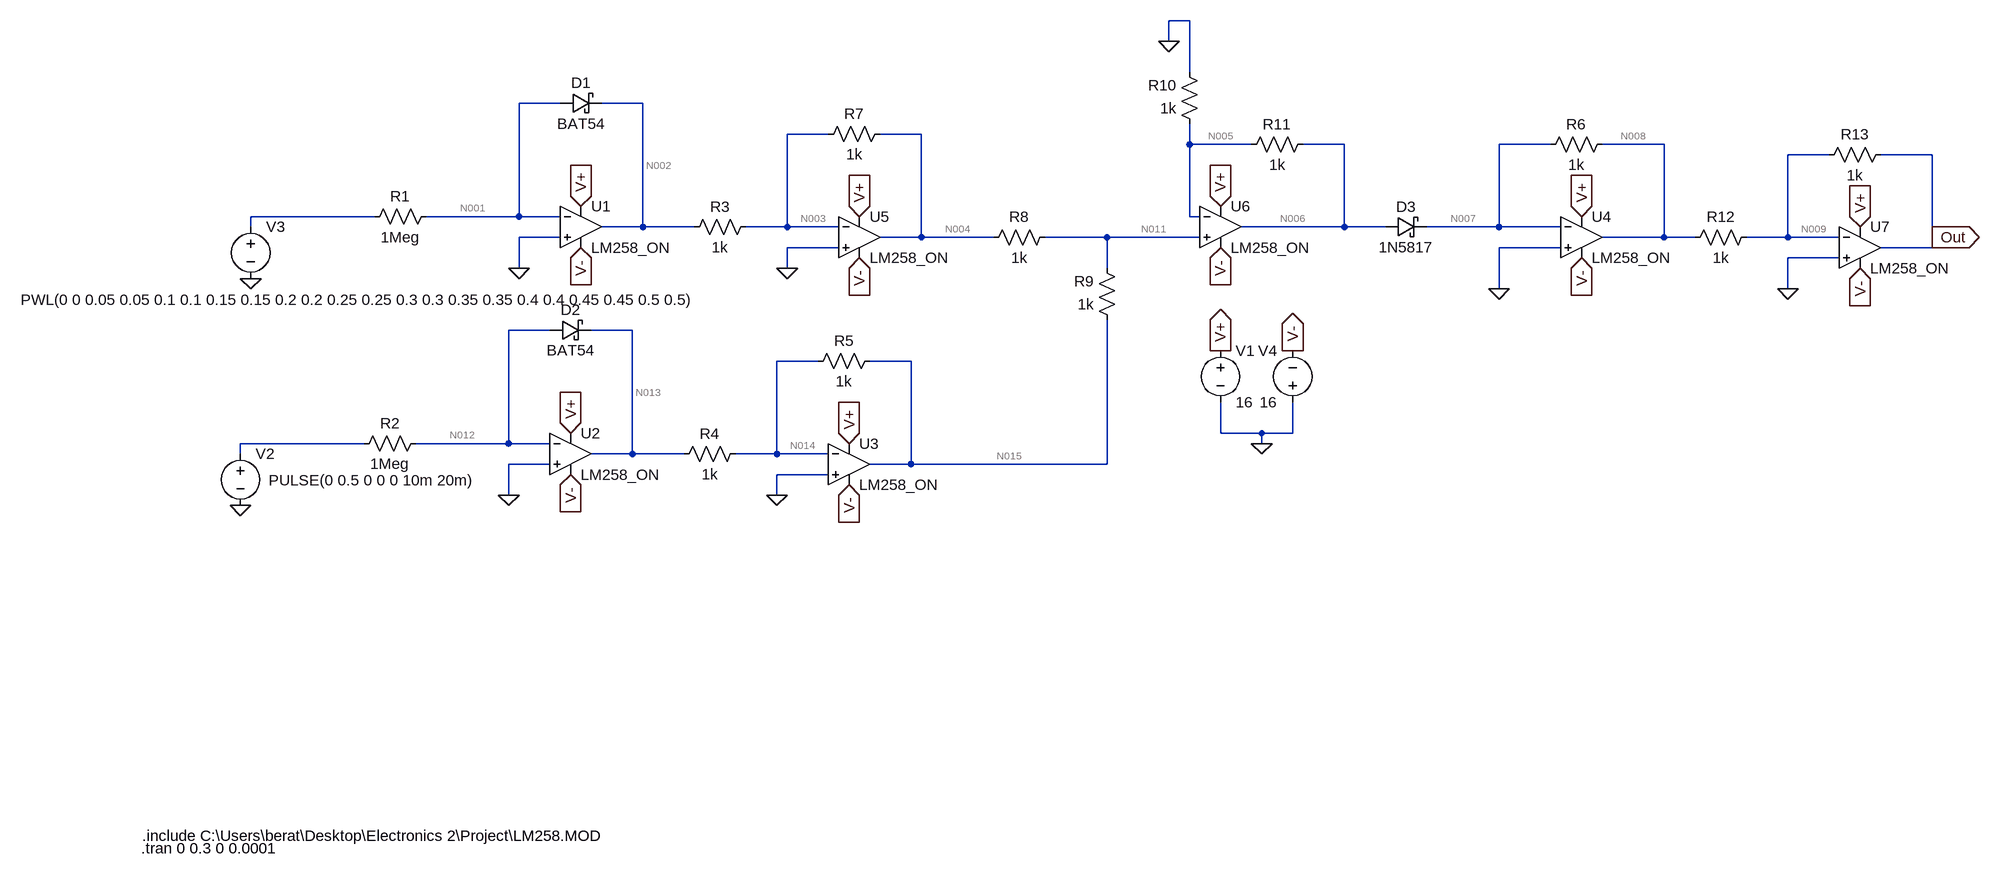
[diagram p0: schematic Draft1.asc]
Draft1.asc, the LTspice schematic file:
Version 4
SHEET 1 2132 680
WIRE 688 -672 656 -672
WIRE 656 -640 656 -672
WIRE 688 -592 688 -672
WIRE -288 -544 -352 -544
WIRE -160 -544 -224 -544
WIRE 128 -496 64 -496
WIRE 272 -496 208 -496
WIRE 688 -480 688 -512
WIRE 784 -480 688 -480
WIRE 928 -480 864 -480
WIRE 1248 -480 1168 -480
WIRE 1424 -480 1328 -480
WIRE 1680 -464 1616 -464
WIRE 1840 -464 1760 -464
WIRE -576 -368 -768 -368
WIRE -352 -368 -352 -544
WIRE -352 -368 -496 -368
WIRE -288 -368 -352 -368
WIRE 688 -368 688 -480
WIRE 704 -368 688 -368
WIRE -768 -352 -768 -368
WIRE -160 -352 -160 -544
WIRE -160 -352 -224 -352
WIRE -80 -352 -160 -352
WIRE 64 -352 64 -496
WIRE 64 -352 0 -352
WIRE 144 -352 64 -352
WIRE 928 -352 928 -480
WIRE 928 -352 768 -352
WIRE 992 -352 928 -352
WIRE 1168 -352 1168 -480
WIRE 1168 -352 1056 -352
WIRE 1264 -352 1168 -352
WIRE -288 -336 -352 -336
WIRE 272 -336 272 -496
WIRE 272 -336 208 -336
WIRE 384 -336 272 -336
WIRE 560 -336 464 -336
WIRE 704 -336 560 -336
WIRE 1424 -336 1424 -480
WIRE 1424 -336 1328 -336
WIRE 1472 -336 1424 -336
WIRE 1616 -336 1616 -464
WIRE 1616 -336 1552 -336
WIRE 1696 -336 1616 -336
WIRE 1840 -336 1840 -464
WIRE 144 -320 64 -320
WIRE 1264 -320 1168 -320
WIRE 1840 -320 1840 -336
WIRE 1840 -320 1760 -320
WIRE 1696 -304 1616 -304
WIRE -352 -288 -352 -336
WIRE 64 -288 64 -320
WIRE 560 -288 560 -336
WIRE 1168 -256 1168 -320
WIRE 1616 -256 1616 -304
WIRE -304 -192 -368 -192
WIRE -176 -192 -240 -192
WIRE 112 -144 48 -144
WIRE 256 -144 192 -144
WIRE 736 -32 736 -80
WIRE 800 -32 736 -32
WIRE 848 -32 848 -80
WIRE 848 -32 800 -32
WIRE -592 -16 -784 -16
WIRE -368 -16 -368 -192
WIRE -368 -16 -512 -16
WIRE -304 -16 -368 -16
WIRE 800 -16 800 -32
WIRE -784 0 -784 -16
WIRE -176 0 -176 -192
WIRE -176 0 -240 0
WIRE -96 0 -176 0
WIRE 48 0 48 -144
WIRE 48 0 -16 0
WIRE 128 0 48 0
WIRE -304 16 -368 16
WIRE 256 16 256 -144
WIRE 256 16 192 16
WIRE 560 16 560 -208
WIRE 560 16 256 16
WIRE 128 32 48 32
WIRE -368 64 -368 16
WIRE 48 64 48 32
FLAG 800 -16 0
FLAG 736 -160 V+
IOPIN 736 -160 Out
FLAG 848 -160 V-
IOPIN 848 -160 Out
FLAG -256 -384 V+
IOPIN -256 -384 In
FLAG -256 -320 V-
IOPIN -256 -320 In
FLAG -768 -272 0
FLAG 1296 -368 V+
IOPIN 1296 -368 In
FLAG 1296 -304 V-
IOPIN 1296 -304 In
FLAG -352 -288 0
FLAG 1168 -256 0
FLAG 176 -368 V+
IOPIN 176 -368 In
FLAG 176 -304 V-
IOPIN 176 -304 In
FLAG -272 -32 V+
IOPIN -272 -32 In
FLAG -272 32 V-
IOPIN -272 32 In
FLAG -784 80 0
FLAG -368 64 0
FLAG 160 -16 V+
IOPIN 160 -16 In
FLAG 160 48 V-
IOPIN 160 48 In
FLAG 64 -288 0
FLAG 48 64 0
FLAG 736 -384 V+
IOPIN 736 -384 In
FLAG 736 -320 V-
IOPIN 736 -320 In
FLAG 656 -640 0
FLAG 1728 -352 V+
IOPIN 1728 -352 In
FLAG 1728 -288 V-
IOPIN 1728 -288 In
FLAG 1616 -256 0
FLAG 1840 -336 Out
IOPIN 1840 -336 Out
SYMBOL OpAmps\\opamp2 -256 -416 R0
SYMATTR InstName U1
SYMATTR Value LM258_ON
SYMBOL voltage 736 -176 R0
WINDOW 123 0 0 Left 0
WINDOW 39 0 0 Left 0
SYMATTR InstName V1
SYMATTR Value 16
SYMBOL res -480 -384 R90
WINDOW 0 0 56 VBottom 2
WINDOW 3 32 56 VTop 2
SYMATTR InstName R1
SYMATTR Value 1Meg
SYMBOL schottky -288 -528 R270
WINDOW 0 32 32 VTop 2
WINDOW 3 0 32 VBottom 2
SYMATTR InstName D1
SYMATTR Value BAT54
SYMATTR Description Diode
SYMATTR Type diode
SYMBOL voltage -768 -368 R0
WINDOW 123 0 0 Left 0
WINDOW 39 0 0 Left 0
WINDOW 3 -357 129 Left 2
SYMATTR InstName V3
SYMATTR Value PWL(0 0 0.05 0.05 0.1 0.1 0.15 0.15 0.2 0.2 0.25 0.25 0.3 0.3 0.35 0.35 0.4 0.4 0.45 0.45 0.5 0.5)
SYMBOL res 16 -368 R90
WINDOW 0 0 56 VBottom 2
WINDOW 3 32 56 VTop 2
SYMATTR InstName R3
SYMATTR Value 1k
SYMBOL schottky 992 -336 R270
WINDOW 0 32 32 VTop 2
WINDOW 3 0 32 VBottom 2
SYMATTR InstName D3
SYMATTR Value 1N5817
SYMATTR Description Diode
SYMATTR Type diode
SYMBOL OpAmps\\opamp2 1296 -400 R0
SYMATTR InstName U4
SYMATTR Value LM258_ON
SYMBOL res 1344 -496 R90
WINDOW 0 0 56 VBottom 2
WINDOW 3 32 56 VTop 2
SYMATTR InstName R6
SYMATTR Value 1k
SYMBOL OpAmps\\opamp2 176 -400 R0
SYMATTR InstName U5
SYMATTR Value LM258_ON
SYMBOL res 224 -512 R90
WINDOW 0 0 56 VBottom 2
WINDOW 3 32 56 VTop 2
SYMATTR InstName R7
SYMATTR Value 1k
SYMBOL OpAmps\\opamp2 -272 -64 R0
SYMATTR InstName U2
SYMATTR Value LM258_ON
SYMBOL res -496 -32 R90
WINDOW 0 0 56 VBottom 2
WINDOW 3 32 56 VTop 2
SYMATTR InstName R2
SYMATTR Value 1Meg
SYMBOL schottky -304 -176 R270
WINDOW 0 32 32 VTop 2
WINDOW 3 0 32 VBottom 2
SYMATTR InstName D2
SYMATTR Value BAT54
SYMATTR Description Diode
SYMATTR Type diode
SYMBOL voltage -784 -16 R0
WINDOW 123 0 0 Left 0
WINDOW 39 0 0 Left 0
WINDOW 3 44 57 Left 2
SYMATTR InstName V2
SYMATTR Value PULSE(0 0.5 0 0 0 10m 20m)
SYMBOL res 0 -16 R90
WINDOW 0 0 56 VBottom 2
WINDOW 3 32 56 VTop 2
SYMATTR InstName R4
SYMATTR Value 1k
SYMBOL OpAmps\\opamp2 160 -48 R0
SYMATTR InstName U3
SYMATTR Value LM258_ON
SYMBOL res 208 -160 R90
WINDOW 0 0 56 VBottom 2
WINDOW 3 32 56 VTop 2
SYMATTR InstName R5
SYMATTR Value 1k
SYMBOL voltage 848 -64 R180
WINDOW 0 24 96 Left 2
WINDOW 3 24 16 Left 2
WINDOW 123 0 0 Left 0
WINDOW 39 0 0 Left 0
SYMATTR InstName V4
SYMATTR Value 16
SYMBOL res 480 -352 R90
WINDOW 0 0 56 VBottom 2
WINDOW 3 32 56 VTop 2
SYMATTR InstName R8
SYMATTR Value 1k
SYMBOL res 576 -192 R180
WINDOW 0 36 76 Left 2
WINDOW 3 36 40 Left 2
SYMATTR InstName R9
SYMATTR Value 1k
SYMBOL OpAmps\\opamp2 736 -416 R0
SYMATTR InstName U6
SYMATTR Value LM258_ON
SYMBOL res 704 -496 R180
WINDOW 0 36 76 Left 2
WINDOW 3 36 40 Left 2
SYMATTR InstName R10
SYMATTR Value 1k
SYMBOL res 768 -464 R270
WINDOW 0 32 56 VTop 2
WINDOW 3 0 56 VBottom 2
SYMATTR InstName R11
SYMATTR Value 1k
SYMBOL OpAmps\\opamp2 1728 -384 R0
SYMATTR InstName U7
SYMATTR Value LM258_ON
SYMBOL res 1568 -352 R90
WINDOW 0 0 56 VBottom 2
WINDOW 3 32 56 VTop 2
SYMATTR InstName R12
SYMATTR Value 1k
SYMBOL res 1776 -480 R90
WINDOW 0 0 56 VBottom 2
WINDOW 3 32 56 VTop 2
SYMATTR InstName R13
SYMATTR Value 1k
TEXT -936 592 Left 2 !.include C:\\Users\\berat\\Desktop\\Electronics 2\\Project\\LM258.MOD
TEXT -938 612 Left 2 !.tran 0 0.3 0 0.0001

The netlist it stands for:
* Draft1.asc
XU1 0 N001 V+ V- N002 LM258_ON  ; pins In+ In- V+ V- OUT
V1 V+ 0 16
R1 N001 N010 1Meg
D1 N001 N002 BAT54
V3 N010 0 PWL(0 0 0.05 0.05 0.1 0.1 0.15 0.15 0.2 0.2 0.25 0.25 0.3 0.3 0.35 0.35 0.4 0.4 0.45 0.45 0.5 0.5)
R3 N003 N002 1k
D3 N006 N007 1N5817
XU4 0 N007 V+ V- N008 LM258_ON  ; pins In+ In- V+ V- OUT
R6 N008 N007 1k
XU5 0 N003 V+ V- N004 LM258_ON  ; pins In+ In- V+ V- OUT
R7 N004 N003 1k
XU2 0 N012 V+ V- N013 LM258_ON  ; pins In+ In- V+ V- OUT
R2 N012 N016 1Meg
D2 N012 N013 BAT54
V2 N016 0 PULSE(0 0.5 0 0 0 10m 20m)
R4 N014 N013 1k
XU3 0 N014 V+ V- N015 LM258_ON  ; pins In+ In- V+ V- OUT
R5 N015 N014 1k
V4 0 V- 16
R8 N011 N004 1k
R9 N015 N011 1k
XU6 N011 N005 V+ V- N006 LM258_ON  ; pins In+ In- V+ V- OUT
R10 N005 0 1k
R11 N005 N006 1k
XU7 0 N009 V+ V- Out LM258_ON  ; pins In+ In- V+ V- OUT
R12 N009 N008 1k
R13 Out N009 1k
.model D D
.lib standard.dio
.include C:\Users\berat\Desktop\Electronics 2\Project\LM258.MOD
.tran 0 0.3 0 0.0001
.backanno
.end

* Results of the author's LTspice run, read from the files saved beside the schematic
* Operating Point, zero values left out:
*   V(v-) = -16 V
*   V(n001) = -1.035 mV
*   V(v+) = 16 V
*   V(n002) = -10.5 mV
*   V(n003) = -1.035 mV
*   V(n006) = 14.7 mV
*   V(n007) = -1.034 mV
*   V(n008) = -18.75 mV
*   V(n004) = 8.386 mV
*   V(n012) = -1.035 mV
*   V(n013) = -10.5 mV
*   V(n014) = -1.035 mV
*   V(n015) = 8.386 mV
*   V(n011) = 8.409 mV
*   V(n005) = 7.374 mV
*   V(n009) = -1.035 mV
*   V(out) = 16.64 mV
*   I(D3) = 17.68 µA
*   I(D2) = 44.18 nA
*   I(D1) = 44.18 nA
*   I(R13) = 17.68 µA
*   I(R12) = 17.72 µA
*   I(R11) = -7.331 µA
*   I(R10) = 7.374 µA
*   I(R9) = -22.75 nA
*   I(R8) = 22.75 nA
*   I(R5) = 9.421 µA
*   I(R4) = 9.464 µA
*   I(R2) = -1.035 nA
*   I(R7) = 9.421 µA
*   I(R6) = -17.72 µA
*   I(R3) = 9.464 µA
*   I(R1) = -1.035 nA
*   I(V4) = -9.217 mA
*   I(V2) = -1.035 nA
*   I(V3) = -1.035 nA
*   I(V1) = 4.423 mA
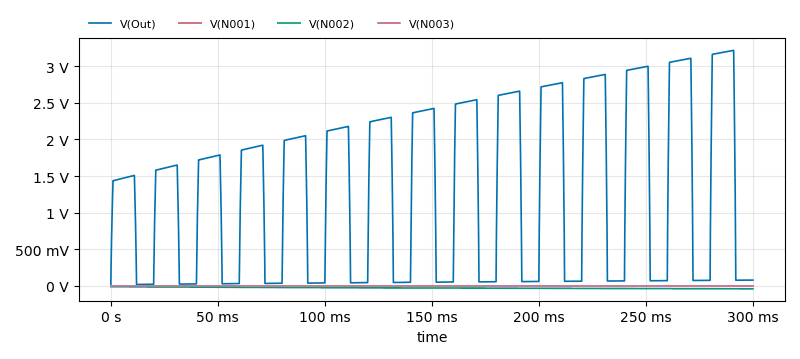
[diagram p1: Transient Analysis of Draft1.asc, plotted from the saved traces]
* Transient Analysis, 1 run:
*   V(Out): min 16.64 mV, max 3.215 V, average 1.342 V, rms 1.786 V, last 79.29 mV
*   V(N001): min -1.04 mV, max -1.034 mV, average -1.034 mV, rms 1.034 mV, last -1.034 mV
*   V(N002): min -39.6 mV, max -10.5 mV, average -27.72 mV, rms 28.89 mV, last -39.6 mV
*   V(N003): min -1.04 mV, max -1.033 mV, average -1.035 mV, rms 1.035 mV, last -1.035 mV